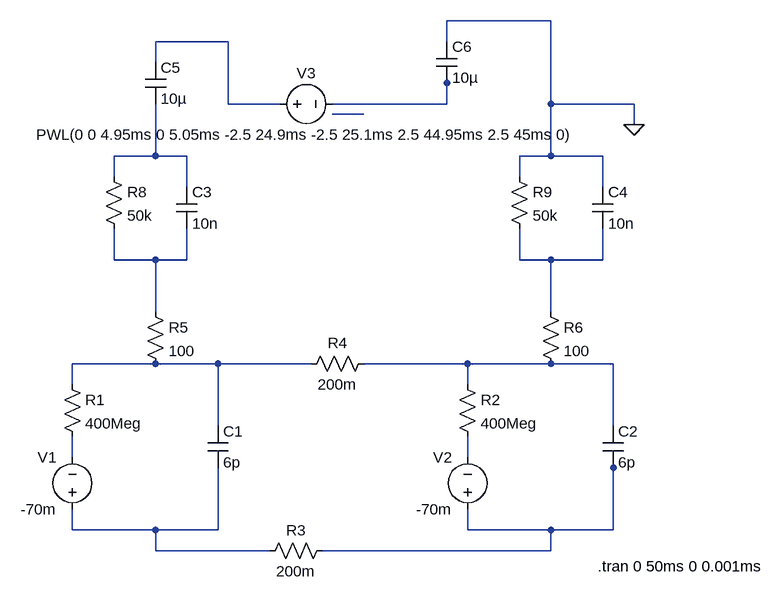
[diagram p0: schematic 電圧刺激等価回路_2compartment.asc]
電圧刺激等価回路_2compartment.asc, the LTspice schematic file:
Version 4
SHEET 1 1116 680
WIRE 736 -496 576 -496
WIRE 240 -464 128 -464
WIRE 576 -464 576 -496
WIRE 128 -432 128 -464
WIRE 576 -400 576 -416
WIRE 240 -368 240 -464
WIRE 320 -368 240 -368
WIRE 576 -368 576 -400
WIRE 576 -368 400 -368
WIRE 736 -368 736 -496
WIRE 864 -368 736 -368
WIRE 448 -352 400 -352
WIRE 864 -336 864 -368
WIRE 128 -288 128 -368
WIRE 128 -288 64 -288
WIRE 176 -288 128 -288
WIRE 736 -288 736 -368
WIRE 736 -288 688 -288
WIRE 816 -288 736 -288
WIRE 64 -256 64 -288
WIRE 688 -256 688 -288
WIRE 176 -240 176 -288
WIRE 816 -240 816 -288
WIRE 64 -128 64 -176
WIRE 128 -128 64 -128
WIRE 176 -128 176 -176
WIRE 176 -128 128 -128
WIRE 688 -128 688 -176
WIRE 736 -128 688 -128
WIRE 816 -128 816 -176
WIRE 816 -128 736 -128
WIRE 128 -48 128 -128
WIRE 736 -48 736 -128
WIRE 128 32 0 32
WIRE 224 32 128 32
WIRE 368 32 224 32
WIRE 608 32 448 32
WIRE 736 32 608 32
WIRE 832 32 736 32
WIRE 0 64 0 32
WIRE 608 64 608 32
WIRE 224 128 224 32
WIRE 832 128 832 32
WIRE 0 176 0 144
WIRE 608 176 608 144
WIRE 832 192 832 176
WIRE 0 288 0 256
WIRE 128 288 0 288
WIRE 224 288 224 192
WIRE 224 288 128 288
WIRE 608 288 608 256
WIRE 736 288 608 288
WIRE 832 288 832 192
WIRE 832 288 736 288
WIRE 128 320 128 288
WIRE 304 320 128 320
WIRE 736 320 736 288
WIRE 736 320 384 320
FLAG 864 -336 0
SYMBOL voltage 304 -368 R270
WINDOW 0 32 56 VTop 2
WINDOW 3 -32 56 VBottom 2
WINDOW 123 0 0 Left 0
WINDOW 39 0 0 Left 0
SYMATTR InstName V3
SYMATTR Value PWL(0 0 4.95ms 0 5.05ms -2.5 24.9ms -2.5 25.1ms 2.5 44.95ms 2.5 45ms 0)
SYMBOL res -16 48 R0
SYMATTR InstName R1
SYMATTR Value 400Meg
SYMBOL res 592 48 R0
SYMATTR InstName R2
SYMATTR Value 400Meg
SYMBOL res 400 304 R90
WINDOW 0 0 56 VBottom 2
WINDOW 3 32 56 VTop 2
SYMATTR InstName R3
SYMATTR Value 200m
SYMBOL res 112 -64 R0
SYMATTR InstName R5
SYMATTR Value 100
SYMBOL res 720 -64 R0
SYMATTR InstName R6
SYMATTR Value 100
SYMBOL cap 208 128 R0
SYMATTR InstName C1
SYMATTR Value 6p
SYMBOL cap 816 128 R0
SYMATTR InstName C2
SYMATTR Value 6p
SYMBOL cap 160 -240 R0
SYMATTR InstName C3
SYMATTR Value 10n
SYMBOL cap 800 -240 R0
SYMATTR InstName C4
SYMATTR Value 10n
SYMBOL res 48 -272 R0
SYMATTR InstName R8
SYMATTR Value 50k
SYMBOL res 672 -272 R0
SYMATTR InstName R9
SYMATTR Value 50k
SYMBOL voltage 0 272 R180
WINDOW 0 24 96 Left 2
WINDOW 3 24 16 Left 2
SYMATTR InstName V1
SYMATTR Value -70m
SYMBOL voltage 608 272 R180
WINDOW 0 24 96 Left 2
WINDOW 3 24 16 Left 2
SYMATTR InstName V2
SYMATTR Value -70m
SYMBOL res 464 16 R90
WINDOW 0 0 56 VBottom 2
WINDOW 3 32 56 VTop 2
SYMATTR InstName R4
SYMATTR Value 200m
SYMBOL cap 112 -432 R0
SYMATTR InstName C5
SYMATTR Value 10µ
SYMBOL cap 560 -464 R0
SYMATTR InstName C6
SYMATTR Value 10µ
TEXT 808 344 Left 2 !.tran 0 50ms 0 0.001ms

The netlist it stands for:
* 電圧刺激等価回路_2compartment.asc
V3 N001 N002 PWL(0 0 4.95ms 0 5.05ms -2.5 24.9ms -2.5 25.1ms 2.5 44.95ms 2.5 45ms 0)
R1 N007 N009 400Meg
R2 N008 N010 400Meg
R3 N011 N012 200m
R5 N005 N007 100
R6 N006 N008 100
C1 N007 N012 6p
C2 N008 N011 6p
C3 N004 N005 10n
C4 0 N006 10n
R8 N004 N005 50k
R9 0 N006 50k
V1 N012 N009 -70m
V2 N011 N010 -70m
R4 N008 N007 200m
C5 N001 N004 10µ
C6 0 N002 10µ
.tran 0 50ms 0 0.001ms
.backanno
.end